# EAGLE design hm11 (EAGLE 7.6.0)
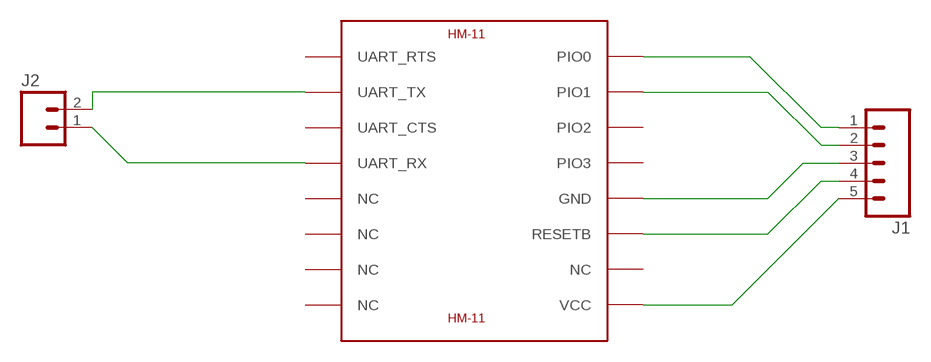
[diagram p0: schematic, sheet 1]

## Parts
J1  M05PTH_LONGPADS  [1X05_LONGPADS]
J2  M02PTH3  [1X02_LONGPADS]
U$1  HM-11  [HM-11]

## Nets
GND: J1.3 U$1.GND
N$2: J1.5 U$1.VCC
N$3: J1.1 U$1.PIO0
N$4: J2.1 U$1.UART_RX
N$6: J1.4 U$1.RESETB
N$7: J1.2 U$1.PIO1
N$8: J2.2 U$1.UART_TX
Unconnected: U$1.NC@5(NC) U$1.NC@6(NC) U$1.NC@7(NC) U$1.NC@8(NC) U$1.NC@10(NC) U$1.PIO2 U$1.PIO3 U$1.UART_CTS U$1.UART_RTS

## Library data of the parts
J1 = SparkFun-Connectors:M05: Header 5 Standard 5-pin 0.1" header. Use with straight break away headers (SKU : PRT-00116), right angle break away headers (PRT-00553), swiss pins (PRT-00743), machine pins (PRT-00117), and female headers (PRT-00115). Molex polarized connector foot print use with SKU : PRT-08230 with associated crimp pins and housings.
J2 = SparkFun-Connectors:M02: Standard 2-pin 0.1" header. Use with - straight break away headers ( PRT-00116) - right angle break away headers (PRT-00553) - swiss pins (PRT-00743) - machine pins (PRT-00117) - female headers (PRT-00115) Molex polarized connector foot print use with: PRT-08233 with associated crimp pins and housings. 2.54_SCREWTERM for use with PRT-10571. 3.5mm Screw Terminal footprints for PRT-08084 5mm Screw Terminal footprints for use with PRT-08432
U$1 = hm-11:HM-11: JNHuaMao HM-11 Bluetooth 4.0 Transceiver based on TI CC2540/CC2541

## Board
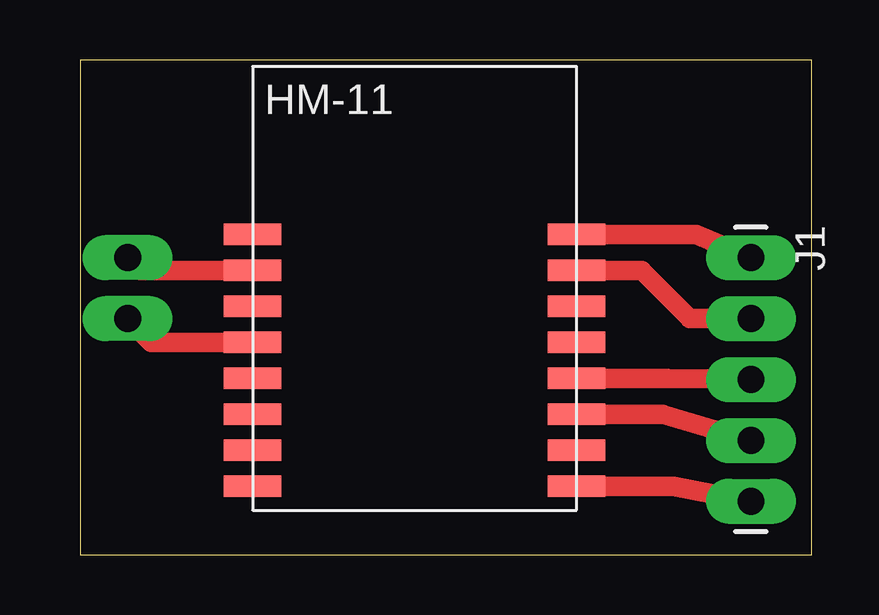
[diagram p1: board, top side]
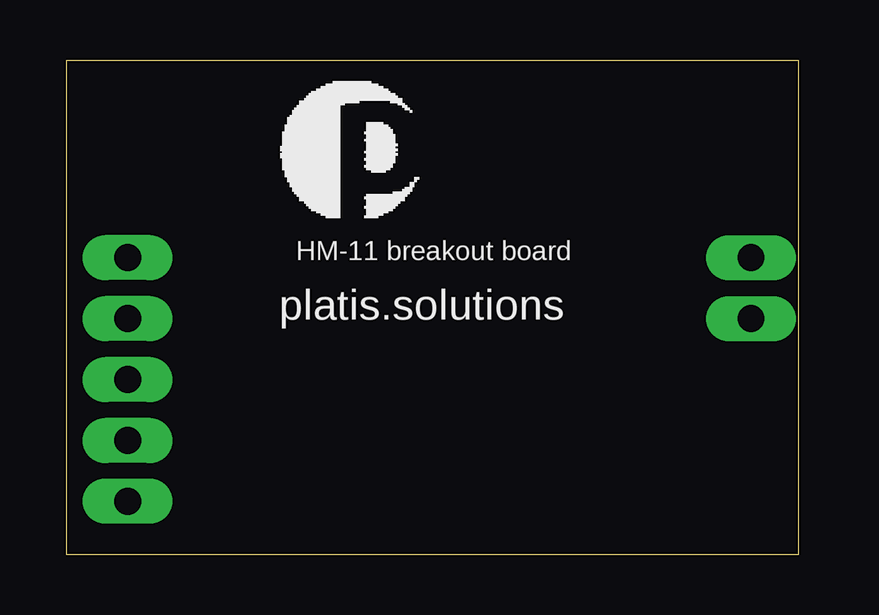
[diagram p2: board, bottom side, seen from below]

Size 30.48 x 20.63 mm. Coordinates in mm from the lower left corner, seen from the top.
Outline: 0,0 30.48,0 30.48,20.63 0,20.63 0,0
Copper layers (1*2*15*16): Top 0.035mm / dielectric 0.2mm / layer 2 0.0175mm / dielectric 1.1mm / layer 15 0.0175mm / dielectric 0.2mm / Bottom 0.035mm
Design rules "SeeedStudio_DRU_no_angle_20130527": minimum track width 6mil, minimum drill 12mil, track to track 6mil, track to pad 6mil, pad to pad 6mil, via to via 6mil, smd to smd 0mil, copper to edge 10mil, drill to drill 10mil, minimum pad ring 6mil, minimum via ring 6mil, stop-mask expansion 2mil, vias tented up to drill 25mil, thermal gap 10mil

### Footprints (pad centres in the part's own frame; a part is rotated, then mirrored left to right if it is on the bottom)
1X05_LONGPADS = drill 1.118 pad 1.88 long: 1 0,0; 2 2.54,0; 3 5.08,0; 4 7.62,0; 5 10.16,0
1X02_LONGPADS = drill 1.118 pad 1.88 long: 1 0,0; 2 2.54,0
HM-11 = smd 2.4 x 0.9: GND 6.5,0; NC@5 -7,0; NC@6 -7,-1.5; NC@7 -7,-3; NC@8 -7,-4.5; NC@10 6.5,-3; PIO0 6.5,6; PIO1 6.5,4.5; PIO2 6.5,3; PIO3 6.5,1.5; RESETB 6.5,-1.5; UART_CTS -7,3; UART_RTS -7,6; UART_RX -7,1.5; UART_TX -7,4.5; VCC 6.5,-4.5

### Placement (x,y rotation side)
J1  27.94,12.38 270 top
J2  1.97,9.84 90 top
U$1  14.17,7.35 0 top

### Tracks (layer width: path | path; a pad name or v marks a point on that pad's centre or on a via)
GND
  Top 0.813: U$1.GND 24.45,7.35 J1.3
N$2
  Top 0.813: U$1.VCC 24.73,2.85 J1.5
N$3
  Top 0.813: U$1.PIO0 25.66,13.35 J1.1
N$4
  Top 0.813: U$1.UART_RX 2.96,8.85 J2.1
N$6
  Top 0.813: U$1.RESETB 24.27,5.85 J1.4
N$7
  Top 0.813: U$1.PIO1 23.39,11.85 25.4,9.84 J1.2
N$8
  Top 0.813: U$1.UART_TX 2.5,11.85 J2.2

### Text on the board
bPlace: HM-11 breakout board | platis.solutions